# Altium schematic sheet 以太网透传模块.SchDoc
size A4
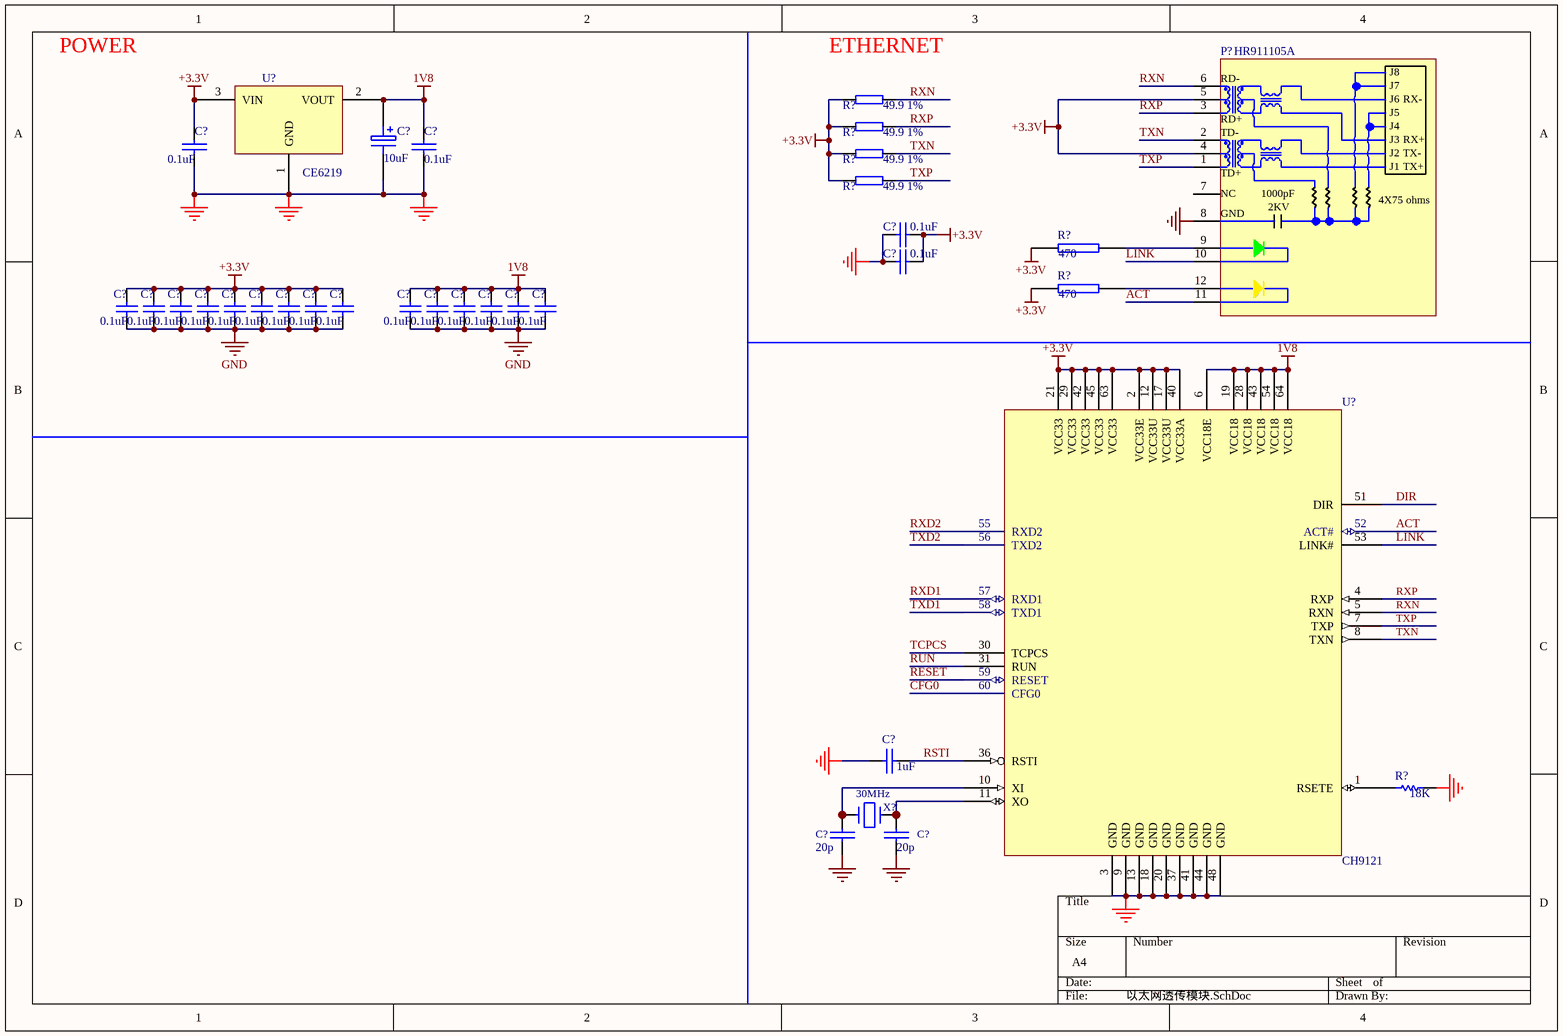
[diagram p0: 以太网透传模块.SchDoc]

## Parts
(Parts that share a designator on the sheet are numbered #1, #2 ... from top to bottom, then left to right.)
C?#1  10uF  [3216]
C?#2  104  [0603]  (value not drawn)
C?#3  104  [0603]  (value not drawn)
C?#4  104  [0603]  (value not drawn)
C?#5  104  [0805]  (value not drawn)
C?#6  value 0.1uF  [0805]  (hidden comment: 104)
C?#7  value 0.1uF  [0805]  (hidden comment: 104)
C?#8  value 0.1uF  [0805]  (hidden comment: 104)
C?#9  value 0.1uF  [0805]  (hidden comment: 104)
C?#10  value 0.1uF  [0805]  (hidden comment: 104)
C?#11  value 0.1uF  [0805]  (hidden comment: 104)
C?#12  value 0.1uF  [0805]  (hidden comment: 104)
C?#13  value 0.1uF  [0805]  (hidden comment: 104)
C?#14  value 0.1uF  [0805]  (hidden comment: 104)
C?#15  value 0.1uF  [0805]  (hidden comment: 104)
C?#16  value 0.1uF  [0805]  (hidden comment: 104)
C?#17  value 0.1uF  [0805]  (hidden comment: 104)
C?#18  value 0.1uF  [0805]  (hidden comment: 104)
C?#19  value 0.1uF  [0805]  (hidden comment: 104)
C?#20  value 0.1uF  [0805]  (hidden comment: 104)
C?#21  105  [0603]  (value not drawn)
C?#22  20  [0603]  (value not drawn)
C?#23  20  [0603]  (value not drawn)
P?  HR911105A  [HR911105A]
R?#1  49.9 1%  [0603]
R?#2  49.9 1%  [0603]
R?#3  49.9 1%  [0603]
R?#4  49.9 1%  [0603]
R?#5  470  [0603]
R?#6  470  [0603]
R?#7  18K  [AXIAL-0.3]
U?#1  CE6219  [SOT-23]
U?#2  CH9121  [LQFP64M_10x10]
X?  30MHz  [4025]

## Nets
1V8: C?#1.1 C?#3.1 C?#15.1 C?#16.1 C?#17.1 C?#18.1 C?#19.1 C?#20.1 U?#1.2(VOUT) U?#2.6(VCC18E) U?#2.19(VCC18) U?#2.28(VCC18) U?#2.43(VCC18) U?#2.54(VCC18) U?#2.64(VCC18)
+3.3V: C?#2.1 C?#4.1 C?#5.1 C?#6.1 C?#7.1 C?#8.1 C?#9.1 C?#10.1 C?#11.1 C?#12.1 C?#13.1 C?#14.1 P?.4 P?.5 R?#1.1 R?#2.1 R?#3.1 R?#4.1 R?#5.1 R?#6.1 U?#1.3(VIN) U?#2.2(VCC33E) U?#2.12(VCC33U) U?#2.17(VCC33U) U?#2.21(VCC33) U?#2.29(VCC33) U?#2.40(VCC33A) U?#2.42(VCC33) U?#2.45(VCC33) U?#2.63(VCC33)
GND: C?#1.2 C?#2.2 C?#3.2 C?#4.2 C?#5.2 C?#6.2 C?#7.2 C?#8.2 C?#9.2 C?#10.2 C?#11.2 C?#12.2 C?#13.2 C?#14.2 C?#15.2 C?#16.2 C?#17.2 C?#18.2 C?#19.2 C?#20.2 C?#21.1 C?#22.2 C?#23.2 P?.8 R?#7.2 U?#1.1(GND) U?#2.3(GND) U?#2.9(GND) U?#2.13(GND) U?#2.18(GND) U?#2.20(GND) U?#2.37(GND) U?#2.41(GND) U?#2.44(GND) U?#2.48(GND)
ACT: P?.11 U?#2.52(ACT#)
CFG0: U?#2.60(CFG0)
DIR: U?#2.51(DIR)
LINK: P?.10 U?#2.53(LINK#)
RESET: U?#2.59(RESET)
RSTI: C?#21.2 U?#2.36(RSTI)
RUN: U?#2.31(RUN)
RXD1: U?#2.57(RXD1)
RXD2: U?#2.55(RXD2)
RXN: P?.6 R?#1.2 U?#2.5(RXN)
RXP: P?.3 R?#2.2 U?#2.4(RXP)
TCPCS: U?#2.30(TCPCS)
TXD1: U?#2.58(TXD1)
TXD2: U?#2.56(TXD2)
TXN: P?.2 R?#3.2 U?#2.8(TXN)
TXP: P?.1 R?#4.2 U?#2.7(TXP)
NetC?#22_1: C?#22.1 U?#2.10(XI) X?.1
NetC?#23_1: C?#23.1 U?#2.11(XO) X?.2
NetP?_9: P?.9 R?#5.2
NetP?_12: P?.12 R?#6.2
NetR?#7_1: R?#7.1 U?#2.1(RSETE)

Not connected (* = marked no-connect by the designer): P? 7

## Notes on the sheet
- POWER
- (near R?#1) ETHERNET
- (in symbol CAP) 0.1uF; 1uF
- (in symbol HR911105A) J8; RD-; J7; J6; RX-; J5; RD+; J4; TD-; J3; RX+; J2; TX-; J1; TX+; TD+; NC; 1000pF; 4X75 ohms; 2KV; GND
- (in symbol Pro1BB.tmp_20p_7) 20p

## Library data of the parts
C?#1 = ELECTRO1: Electrolytic Capacitor
C?#2-C?#5 C?#21 = CAP: Capacitor
C?#6-C?#20 = Cap: Capacitor; Published: 8-Jun-2000; LatestRevisionDate: 17-Jul-2002; LatestRevisionNote: Re-released for DXP Platform.; PackageReference: RAD-0.3; Publisher: Altium Limited
C?#22 C?#23 = Pro1BB.tmp_20p_7
R?#1-R?#4 = DZ
R?#5 R?#6 = RES2
R?#7 = Res1: Resistor; Published: 8-Jun-2000; LatestRevisionDate: 17-Jul-2002; LatestRevisionNote: Re-released for DXP Platform.; PackageReference: AXIAL-0.3; Publisher: Altium Limited; PackageDescription: Axial Device, Thru-Hole; 2 Leads; 0.3 in Pin Spacing; Value: 18K
U?#1 = LM1117_3.3V
X? = Pro1BB.tmp_12MHz_6